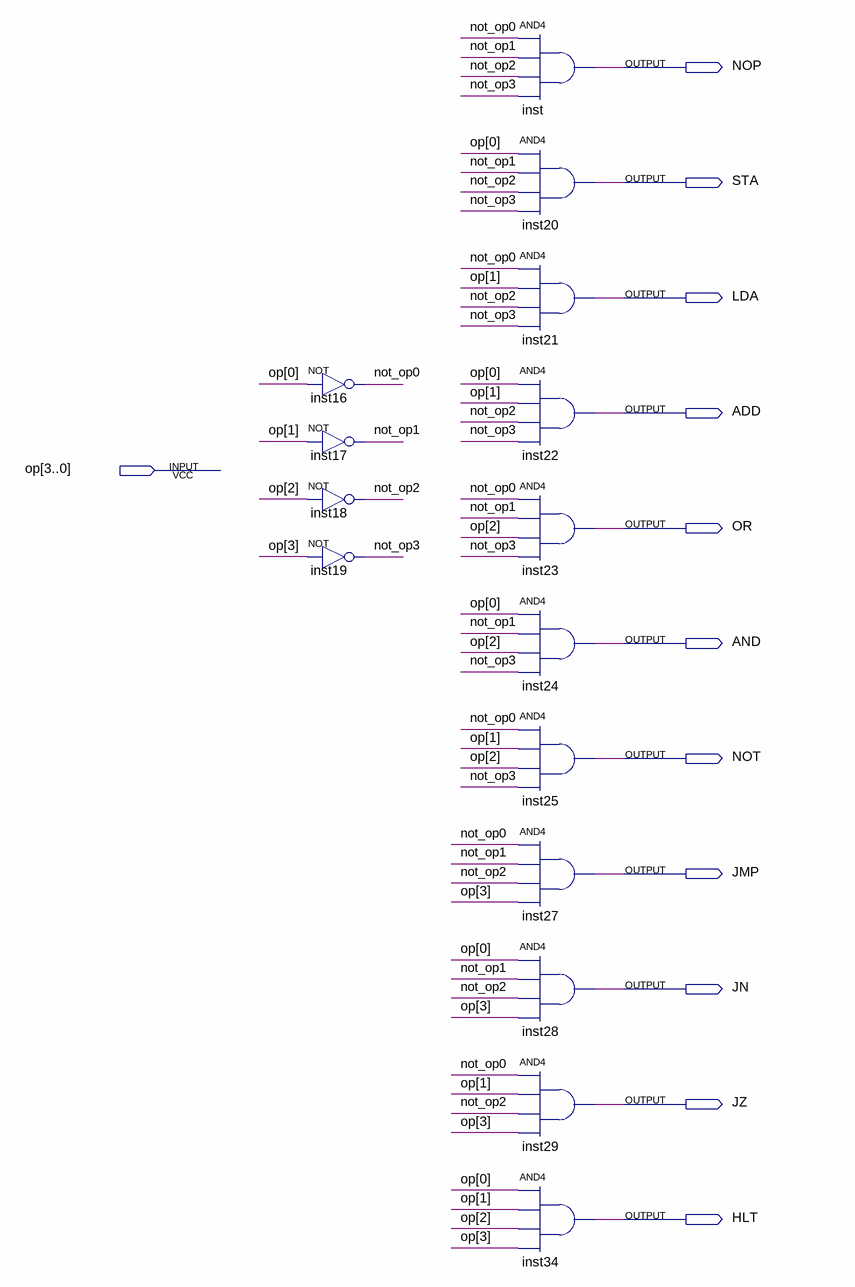
[diagram p0: schematic sheet]
// Quartus schematic decod_op.bdf as structural Verilog: 15 symbols, 12 pins
module decod_op (
  input  [3:0] op,
  output NOP,
  output STA,
  output LDA,
  output ADD,
  output OR,
  output AND,
  output NOT,
  output JMP,
  output JN,
  output JZ,
  output HLT
);

  wire not_op0, not_op1, not_op2, not_op3;

  not inst16 (not_op0, op[0]);
  not inst17 (not_op1, op[1]);
  not inst18 (not_op2, op[2]);
  not inst19 (not_op3, op[3]);
  and inst (NOP, not_op0, not_op1, not_op2, not_op3);
  and inst20 (STA, op[0], not_op1, not_op2, not_op3);
  and inst21 (LDA, not_op0, op[1], not_op2, not_op3);
  and inst22 (ADD, op[0], op[1], not_op2, not_op3);
  and inst23 (OR, not_op0, not_op1, op[2], not_op3);
  and inst24 (AND, op[0], not_op1, op[2], not_op3);
  and inst25 (NOT, not_op0, op[1], op[2], not_op3);
  and inst27 (JMP, not_op0, not_op1, not_op2, op[3]);
  and inst28 (JN, op[0], not_op1, not_op2, op[3]);
  and inst29 (JZ, not_op0, op[1], not_op2, op[3]);
  and inst34 (HLT, op[0], op[1], op[2], op[3]);
endmodule
